# Altium schematic sheet 1k 0402 SCH.schdoc
size 44 x 27 mm
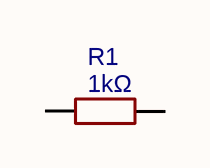
[diagram p0: 1k 0402 SCH.schdoc]

## Parts
R1  1kΩ  [R0402]

## Nets

Not connected (* = marked no-connect by the designer): R1 1 2

## Library data of the parts
R1 = 1kΩ: Manufacturer: YAGEO(国巨); Manufacturer Part: RC0402FR-071KL; nameAlias: Value; Supplier: LCSC; Supplier Part: C106235; JLCPCB Part Class: Extended Part; spicePre: R; spiceSymbolName: RC0402FR-071KL